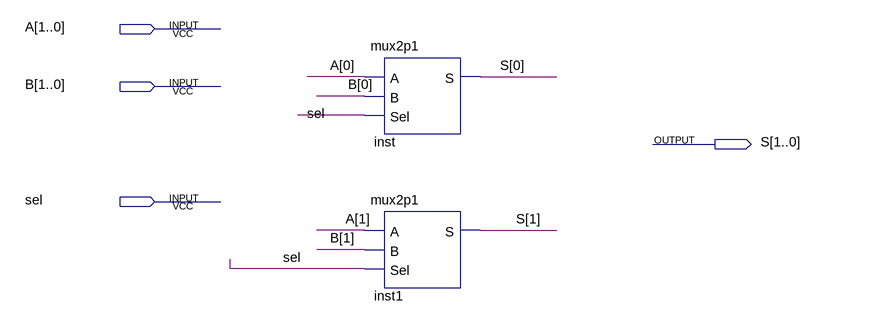
[diagram p0: schematic sheet]
// Quartus schematic mux2b.bdf as structural Verilog: 2 symbols, 4 pins
module mux2b (
  input  [1:0] A,
  input  [1:0] B,
  input  sel,
  output [1:0] S
);

  mux2p1 inst (.A(A[0]), .B(B[0]), .Sel(sel), .S(S[0]));
  mux2p1 inst1 (.A(A[1]), .B(B[1]), .Sel(sel), .S(S[1]));
endmodule
